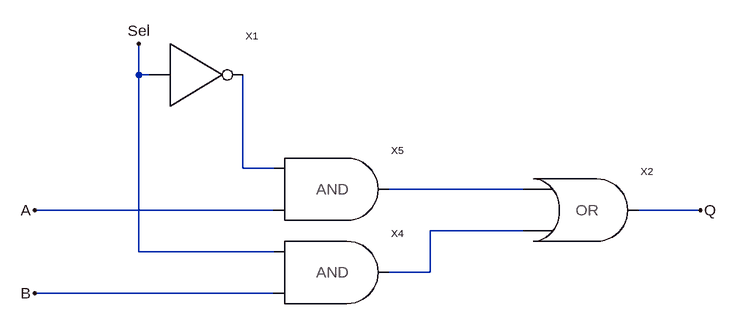
[diagram p0: schematic mul.asc]
mul.asc, the LTspice schematic file:
Version 4
SHEET 1 1108 680
WIRE 128 -48 128 -96
WIRE 144 -48 128 -48
WIRE 288 96 288 -48
WIRE 336 96 288 96
WIRE 720 128 512 128
WIRE 336 160 -32 160
WIRE 992 160 896 160
WIRE 720 192 576 192
WIRE 128 224 128 -48
WIRE 336 224 128 224
WIRE 576 256 576 192
WIRE 576 256 512 256
WIRE 336 288 -32 288
FLAG -32 160 A
FLAG -32 288 B
FLAG 992 160 Q
FLAG 128 -96 Sel
SYMBOL inverter 176 -48 R0
SYMATTR InstName X1
SYMBOL OR_2 736 160 R0
SYMATTR InstName X2
SYMBOL AND_2 352 256 R0
SYMATTR InstName X4
SYMBOL AND_2 352 128 R0
SYMATTR InstName X5

The netlist it stands for:
* mul.asc
XX1 Sel N001 inverter  ; pins Vin Vout
XX2 N002 N003 Q OR_2  ; pins Vin1 Vin2 Vout
XX4 Sel B N003 AND_2  ; pins Vin1 Vin2 Vout
XX5 N001 A N002 AND_2  ; pins Vin1 Vin2 Vout
.backanno
.end